# EAGLE schematic amg8833 (EAGLE 8.5.0)
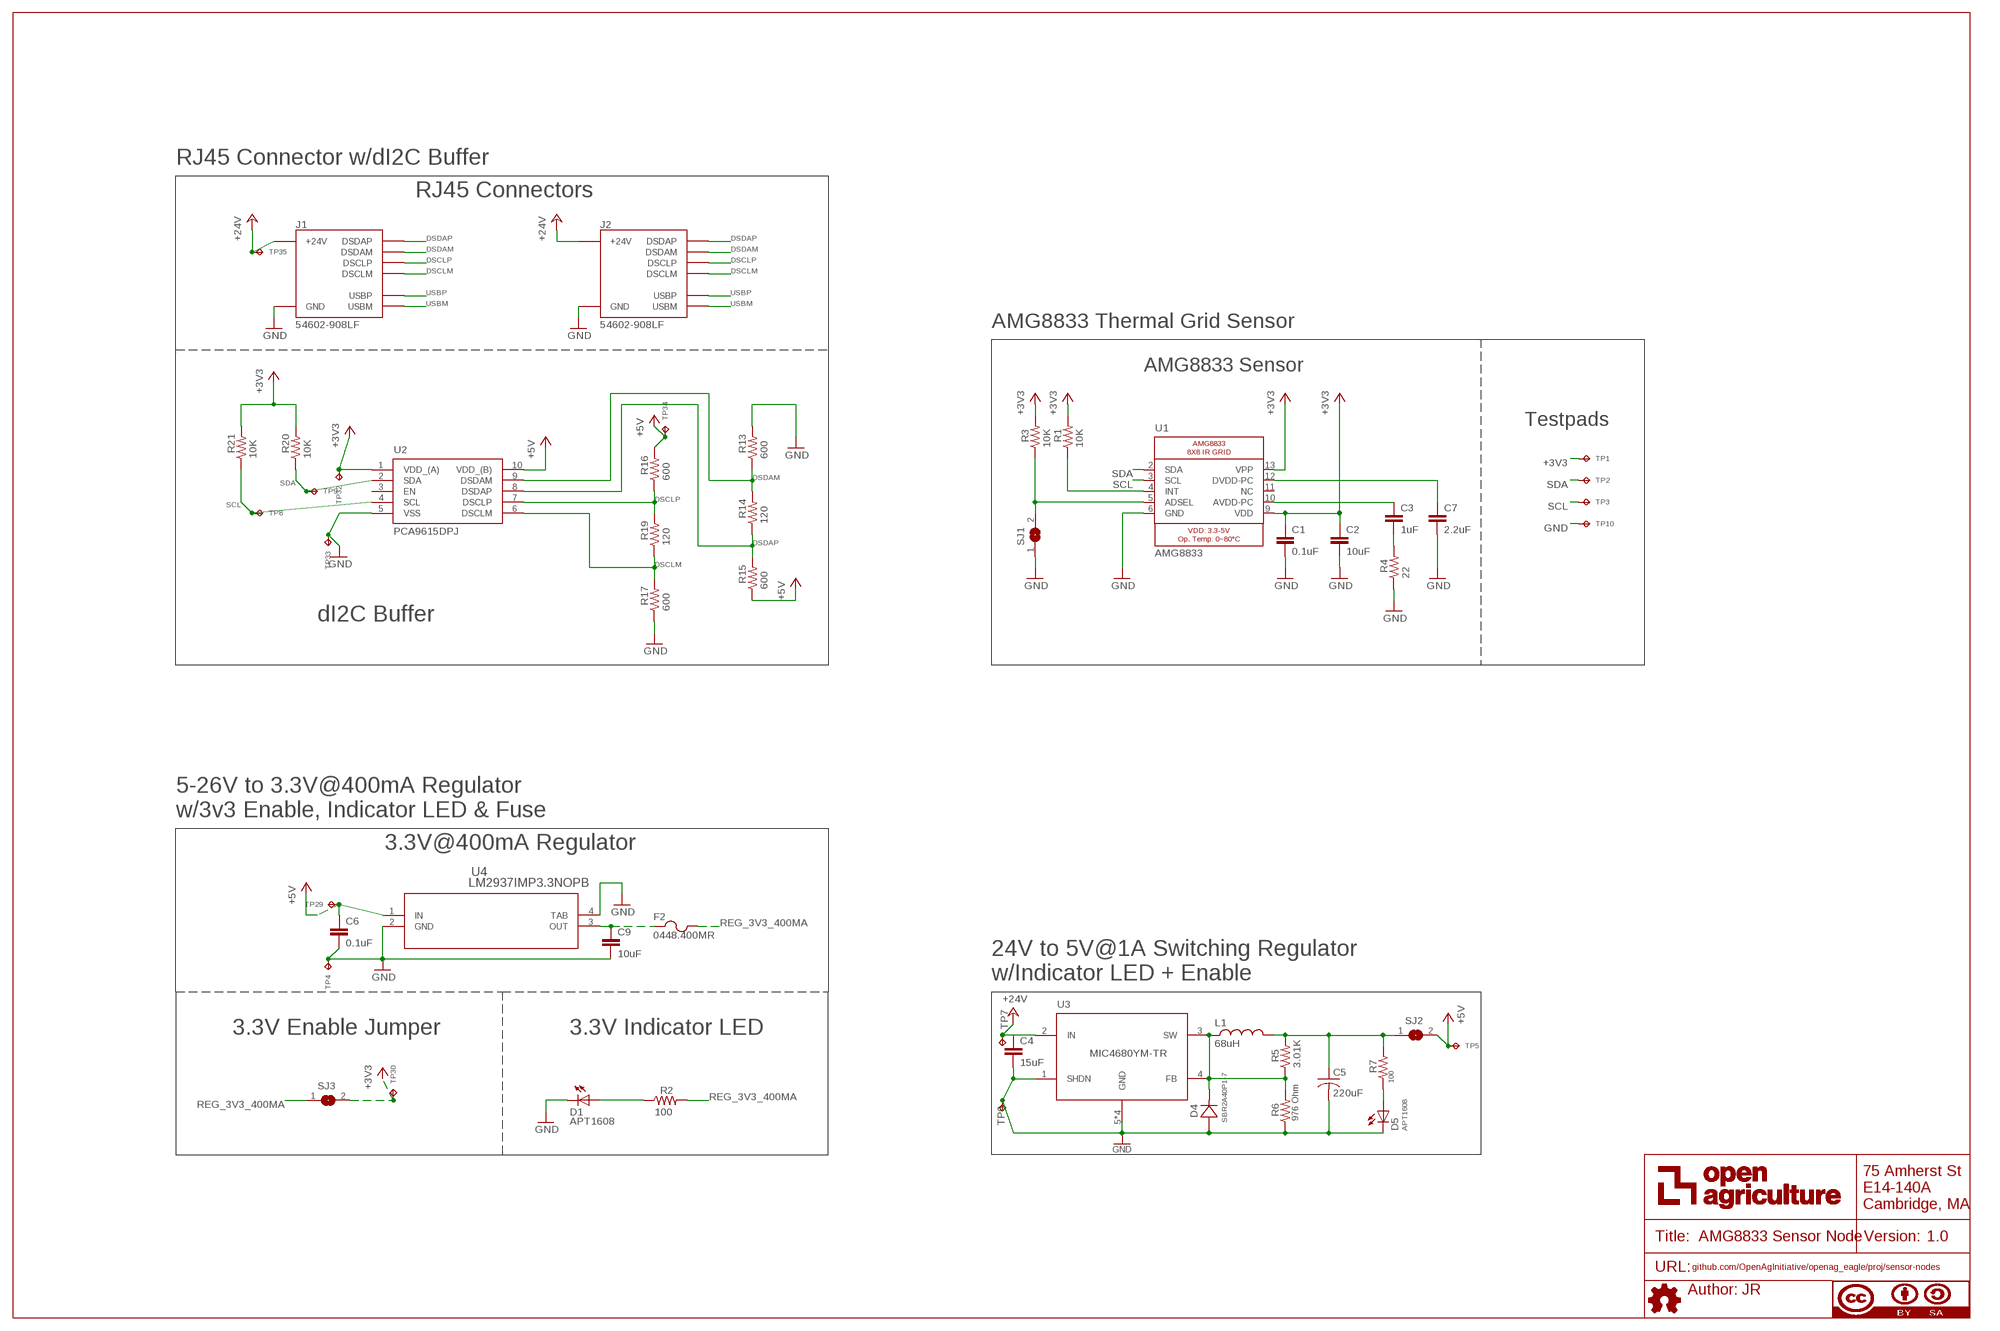
[diagram p0: schematic, sheet 1]

## Parts
C1  0.1uF  0.1UF-C0603C104K5RACTU  [C0603]
C2  10uF  10UF-GMK212BBJ106KG-T  [C0805]
C3  1uF  1UF-CL10A105KB8NNNC  [C0603]
C4  15uF  15UF-C2012X5R1V156M125AC  [C0805]
C5  220uF  220UF-TPSY227K010R0100  [CT7343]
C6  0.1uF  0.1UF-C0603C104K5RACTU  [C0603]
C7  2.2uF  2.2UF-GRM188R6YA225KA12D  [C0603]
C9  10uF  10UF-GMK212BBJ106KG-T  [C0805]
D1  APT1608  APT1608CGCK  [CHIPLED_0603]
D4  SBR2A40P1-7  [POWERDI123]
D5  APT1608  APT1608CGCK  [CHIPLED_0603]
F2  0448.400MR  0438.375WR  [0603]
FRAME1  DOCFIELD  [DOCFIELD]
J1  54602-908LF  OPENAG-V1-RJ45PTH  [OPENAG-V1-RJ45]
J2  54602-908LF  OPENAG-V1-RJ45PTH  [OPENAG-V1-RJ45]
L1  68uH  68UH-UP2B-680-R  [UP2B]
R1  10K  10K-ERJ-3EKF1002V  [RC0603N]
R2  100  100OHM-RC0603JR-07100RL  [RC0603N]
R3  10K  10K-ERJ-3EKF1002V  [RC0603N]
R4  22  22OHM-RC0603JR-0722RL  [RC0603N]
R5  3.01K  3.01K-RC0603FR-073K01L  [RC0603N]
R6  976 Ohm  982OHM-RC0603FR-07976RL  [RC0603N]
R7  100  100OHM-RC0603JR-07100RL  [RC0603N]
R13  600  600OHM-RC0603FR-07604RL  [RC0603N]
R14  120  120OHM-RC0603FR-07120RL  [RC0603N]
R15  600  600OHM-RC0603FR-07604RL  [RC0603N]
R16  600  600OHM-RC0603FR-07604RL  [RC0603N]
R17  600  600OHM-RC0603FR-07604RL  [RC0603N]
R19  120  120OHM-RC0603FR-07120RL  [RC0603N]
R20  10K  10K-ERJ-3EKF1002V  [RC0603N]
R21  10K  10K-ERJ-3EKF1002V  [RC0603N]
SJ1  SOLDERJUMPERREFLOW_NOPASTE  [SOLDERJUMPER_REFLOW_NOPASTE]
SJ2  SOLDERJUMPERREFLOW_NOPASTE  [SOLDERJUMPER_REFLOW_NOPASTE]
SJ3  SOLDERJUMPERREFLOW_NOPASTE  [SOLDERJUMPER_REFLOW_NOPASTE]
TP1  TPTP04R  [TP04R]
TP2  TPTP04R  [TP04R]
TP3  TPTP04R  [TP04R]
TP4  TPTP06R  [TP06R]
TP5  TPTP06R  [TP06R]
TP6  TPTP06R  [TP06R]
TP7  TPTP06R  [TP06R]
TP8  TPTP06R  [TP06R]
TP9  TPTP06R  [TP06R]
TP10  TPTP04R  [TP04R]
TP29  TPTP06R  [TP06R]
TP30  TPTP06R  [TP06R]
TP32  TPTP06R  [TP06R]
TP33  TPTP06R  [TP06R]
TP34  TPTP06R  [TP06R]
TP35  TPTP06R  [TP06R]
U1  AMG8833  [AMG8833]
U2  PCA9615DPJ  [SOP50P490X110-10N]
U3  MIC4680YM-TR  [SOIC8]
U4  LM2937IMP3.3NOPB  LM2937IMP-3.3/NOPB  [MP04A]

## Nets
+3V3: C1.1 C2.1 R1.2 R3.2 R20.2 R21.2 SJ3.2 TP1.1(TP) TP30.TP TP32.TP U1.9(VDD) U1.13(VPP) U2.1(VDD_(A))
+5V: C6.1 R15.1 R16.2 SJ2.2 TP5.TP TP29.TP TP34.TP U2.10(VDD_(B)) U4.1(IN)
+24V: C4.1 J1.24V(6)(+24V) J2.24V(6)(+24V) TP7.TP TP35.TP U3.2(IN)
DSCLM: J1.DSCLM(5)(DSCLM) J2.DSCLM(5)(DSCLM) R17.2 R19.1 U2.6(DSCLM)
DSCLP: J1.DSCLP(4)(DSCLP) J2.DSCLP(4)(DSCLP) R16.1 R19.2 U2.7(DSCLP)
DSDAM: J1.DSDAM(2)(DSDAM) J2.DSDAM(2)(DSDAM) R13.1 R14.2 U2.9(DSDAM)
DSDAP: J1.DSDAP(1)(DSDAP) J2.DSDAP(1)(DSDAP) R14.1 R15.2 U2.8(DSDAP)
GND: C1.2 C2.2 C4.2 C5.-(2(-)) C6.2 C7.2 C9.2 D1.C D4.- D5.C J1.GND(3)(GND) J2.GND(3)(GND) R4.1 R6.1 R13.2 R17.1 SJ1.1 TP4.TP TP6.TP TP10.1(TP) TP33.TP U1.6(GND) U2.5(VSS) U3.1(SHDN) U3.5(GND) U3.6(GND) U3.7(GND) U3.8(GND) U4.2(GND) U4.4(TAB)
N$4: D1.A R2.1
N$5: C9.1 F2.1 U4.3(OUT)
N$6: R1.1 U1.4(INT)
N$7: R3.1 SJ1.2 U1.5(ADSEL)
N$8: C3.2 R4.2
N$12: C3.1 U1.10(AVDD-PC)
N$13: C7.1 U1.12(DVDD-PC)
N$31: D4.+ L1.1 R5.1 R6.2 U3.3(SW) U3.4(FB)
N$32: D5.A R7.1
N$33: C5.+(1(+)) L1.2 R5.2 R7.2 SJ2.1
REG_3V3_400MA: F2.2 R2.2 SJ3.1
SCL: R21.1 TP3.1(TP) TP8.TP U1.3(SCL) U2.4(SCL)
SDA: R20.1 TP2.1(TP) TP9.TP U1.2(SDA) U2.2(SDA)
USBM: J1.USBM(8)(USBM) J2.USBM(8)(USBM)
USBP: J1.USBP(7)(USBP) J2.USBP(7)(USBP)
Unconnected: U1.11(NC) U2.3(EN)

## Notes on the sheet
- RJ45 Connector w/dI2C Buffer
- RJ45 Connectors
- AMG8833 Thermal Grid Sensor
- AMG8833 Sensor
- Testpads
- dI2C Buffer
- 5-26V to 3.3V@400mA Regulator 
  w/3v3 Enable, Indicator LED & Fuse
- 3.3V@400mA Regulator
- 24V to 5V@1A Switching Regulator
  w/Indicator LED + Enable
- 3.3V Enable Jumper | 3.3V Indicator LED

## Library data of the parts
C1 C6 = openag-capacitors:0.1UF-C0603C104K5RACTU: Kemet - C0603C104K5RACTU - CAP CER 0.1UF 50V X7R 0603 Description: 0.1µF ±10% 50V Ceramic Capacitor X7R 0603 (1608 Metric) Technical Specifications: Capacitance: 0.1µF Tolerance: ±10% Rated Voltage: 50V Temperature Coefficient: X7R Operating Temperature: -55°C ~ 125°C Package / Case: 0603 (1608 Metric) Datasheet(s): X7R Dielectric, 6.3-250 VDC <https://search.kemet.com/component-edge/download/datasheet/C0603C104K5RACTU.pdf> Vendor(s): Digikey: 399-5089-1-ND <https://www.digikey.com/product-detail/en/kemet/C0603C104K5RACTU/399-5089-1-ND/1465623>; POPULATE: YES; VERIFIED: NO
C2 C9 = openag-capacitors:10UF-GMK212BBJ106KG-T: Taiyo Yuden - GMK212BBJ106KG-T - CAP CER 10UF 35V X5R 0805 Description: 10µF ±10% 35V Ceramic Capacitor X5R 0805 (2012 Metric) Technical Specifications: Capacitance: 10µF Tolerance: ±10% Rated Voltage: 35V Temperature Coefficient: X5R Operating Temperature: -55°C ~ 85°C Package / Case: 0805 (2012 Metric) Datasheet(s): GMK212BBJ106KG-T Spec <http://ds.yuden.co.jp/TYCOMPAS/ut/detail.do?productNo=GMK212BBJ106KG-T&fileName=GMK212BBJ106KG-T_SS&mode=specSheetDownload> Vendor(s): Digikey: 587-4893-1-ND <https://www.digikey.com/product-detail/en/taiyo-yuden/GMK212BBJ106KG-T/587-4893-1-ND/6563736>; POPULATE: YES; VERIFIED: NO
C3 = openag-capacitors:1UF-CL10A105KB8NNNC: Samsung - CL10A105KB8NNNC - CAP CER 1UF 50V X5R 0603 Description: 1µF ±10% 50V Ceramic Capacitor X5R 0603 (1608 Metric) Technical Specifications: Capacitance: 1µF Tolerance: ±10% Rated Voltage: 50V Temperature Coefficient: X5R Operating Temperature: -55°C ~ 85°C Packaging / Case: 0603 (1608 Metric) Datasheet(s): CL10A105KB8NNNC Spec <http://www.samsungsem.com/kr/support/product-search/mlcc/CL10A105KB8NNNC.jsp> Vendor(s): Digikey: 1276-1860-1-ND <https://www.digikey.com/product-detail/en/samsung-electro-mechanics-america-inc/CL10A105KB8NNNC/1276-1860-1-ND/3889946>; POPULATE: YES; VERIFIED: NO
C4 = openag-capacitors:15UF-C2012X5R1V156M125AC: TDK Corporation - C2012X5R1V156M125AC - CAP CER 15UF 35V X5R 0805 Description: 15µF ±20% 35V Ceramic Capacitor X5R 0805 (2012 Metric) Technical Specifications: Capacitance: 15µF Tolerance: ±20% Voltage - Rated: 35V Temperature Coefficient: X5R Operating Temperature: -55°C ~ 85°C Features: Low ESL Applications: General Purpose Mounting Type: Surface Mount, MLCC Package / Case: 0805 (2012 Metric) Size / Dimension: 0.079" L x 0.049" W (2.00mm x 1.25mm) Thickness (Max): 0.057" (1.45mm) Datasheet(s): C Series, General Datasheet <https://product.tdk.com/info/en/catalog/datasheets/mlcc_commercial_general_en.pdf> MLCC Part Number Guide <https://product.tdk.com/en/products/common/pdf/mlcc_partnumber_description.pdf> C Series, Gen Appl & Mid-Voltage Spec <https://product.tdk.com/info/en/catalog/spec/mlccspec_commercial_general_midvoltage_en.pdf> Vendor(s): Digikey: 445-14423-1-ND <https://www.digikey.com/product-detail/en/tdk-corporation/C2012X5R1V156M125AC/445-14423-1-ND/3956089>
C5 = openag-capacitors:220UF-TPSY227K010R0100: AVX Corporation - TPSY227K010R0100 - CAP TANT 220UF 10V 10% 2917 Description: 220µF Molded Tantalum Capacitors 10V 2917 (7343 Metric) 100 mOhm Technical Specifications: Capacitance: 220µF Tolerance: ±10% Voltage - Rated: 10V Type: Molded ESR (Equivalent Series Resistance): 100 mOhm Operating Temperature: -55°C ~ 125°C Mounting Type: Surface Mount Package / Case: 2917 (7343 Metric) Size / Dimension: 0.287" L x 0.169" W (7.30mm x 4.30mm) Height - Seated (Max): 0.079" (2.00mm) Manufacturer Size Code: Y Features: General Purpose Datasheet(s): TPS Series, Low ESR <http://datasheets.avx.com/TPS.pdf> Vendor(s): Digikey: 478-5408-1-ND <https://www.digikey.com/scripts/DkSearch/dksus.dll?Detail&itemSeq=250948888&uq=636531796868737363>
C7 = openag-capacitors:2.2UF-GRM188R6YA225KA12D: Murata Electronics North America - GRM188R6YA225KA12D - CAP CER 2.2UF 35V X5R 0603 Description: 2.2µF ±10% 35V Ceramic Capacitor X5R 0603 (1608 Metric) Technical Specifications: Capacitance: 2.2µF Tolerance: ±10% Voltage - Rated: 35V Temperature Coefficient: X5R Operating Temperature: -55°C ~ 85°C Applications: General Purpose Mounting Type: Surface Mount, MLCC Package / Case: 0603 (1608 Metric) Size / Dimension: 0.063" L x 0.032" W (1.60mm x 0.80mm) Thickness (Max): 0.035" (0.90mm) Datasheet(s): Chip Monolithic Ceramic Caps Catalog <https://www.murata.com/~/media/webrenewal/support/library/catalog/products/capacitor/mlcc/c02e.ashx> Chip Monolithic Ceramic Caps Part Numbering <https://search.murata.co.jp/Ceramy/image/img/A01X/partnumbering_e_01.pdf> Specifications and Test Methods 3p <http://search.murata.co.jp/Ceramy/image/img/A01X/C1606E.pdf> GRM188R6YA225KA12 Ref Sheet <http://search.murata.co.jp/Ceramy/image/img/A01X/G101/ENG/GRM188R6YA225KA12-01.pdf> Vendor(s): Digikey: 490-7204-1-ND <https://www.digikey.com/product-detail/en/murata-electronics-north-america/GRM188R6YA225KA12D/490-7204-1-ND/3900456>
D1 D5 = openag-diodes:APT1608CGCK: Kingbright - APT1608CGCK - LED GREEN CLEAR 0603 SMD Description: Green 570nm LED Indication - Discrete 2.1V 0603 (1608 Metric) Technical Specifications: Color: Green Lens Color: Colorless Lens Transparency: Clear Millicandela Rating: 50mcd Lens Style/Size: Rectangle with Flat Top, 1.20mm x 0.80mm Voltage - Forward (Vf) (Typ): 2.1V Current - Test: 20mA Viewing Angle: 120° Mounting Type: Surface Mount Wavelength - Dominant: 570nm Wavelength - Peak: 574nm Package / Case: 0603 (1608 Metric) Supplier Device Package: Chip LED Size / Dimension: 1.60mm L x 0.80mm W Height (Max): 0.75mm Datasheet(s): APT1608CGCK <http://www.kingbrightusa.com/images/catalog/SPEC/APT1608CGCK.pdf> Vendor(s): Digikey: 754-1116-1-ND <https://www.digikey.com/product-detail/en/kingbright/APT1608CGCK/754-1116-1-ND/1747833#>; POPULATE: YES; VERIFIED: NO
D4 = openag-diodes:SBR2A40P1-7: Diodes Incorporated - SBR2A40P1-7 - DIODE SBR 40V 2A POWERDI123 Description: Diode Super Barrier 40V 2A Surface Mount PowerDI™ 123 Technical Specifications: Diode Type: Super Barrier Voltage - DC Reverse (Vr) (Max): 40V Current - Average Rectified (Io): 2A Voltage - Forward (Vf) (Max) @ If: 500mV @ 2A Speed: Standard Recovery >500ns, > 200mA (Io) Current - Reverse Leakage @ Vr: 100µA @ 40V Mounting Type: Surface Mount Package / Case: POWERDI®123 Supplier Device Package: PowerDI™ 123 Operating Temperature - Junction: -65°C ~ 150°C Base Part Number: SBR2A40 Datasheet(s): SBR2A40P1 <https://www.diodes.com/assets/Datasheets/SBR2A40P1.pdf> Vendor(s): Digikey: SBR2A40P1DITR-ND <https://www.digikey.com/product-detail/en/diodes-incorporated/SBR2A40P1-7/SBR2A40P1DITR-ND/1681825>
F2 = openag-fuses:0438.375WR: Littelfuse Inc. - 0448.400MR - FUSE BOARD MNT 400MA 125VAC/VDC Description: FUSE BOARD MNT 400MA 125VAC/VDC Technical Specifications: Fuse Type: Board Mount (Cartridge Style Excluded) Current Rating: 400mA Voltage Rating - AC: 125V Voltage Rating - DC: 125V Response Time: Fast Package / Case: 2-SMD, Square End Block Mounting Type: Surface Mount Breaking Capacity @ Rated Voltage: 50A Melting I²t: 0.0416 Approvals: CSA, UL Operating Temperature: -55°C ~ 125°C Size / Dimension: 0.240" L x 0.106" W x 0.106" H (6.10mm x 2.69mm x 2.69mm) DC Cold Resistance: 0.4895 Ohms Datasheet(s): 448 Series Datasheet <http://www.littelfuse.com/~/media/electronics/datasheets/fuses/littelfuse_fuse_448_datasheet.pdf.pdf> Vendor(s): Digikey: F5573CT-ND <https://www.digikey.com/product-detail/en/littelfuse-inc/0448.400MR/F5573CT-ND/3306934>; POPULATE: YES; VERIFIED: YES
FRAME1 = openag-frames:DOCFIELD: DOCUMENT FIELD; AUTHOR: JR; TITLE: AMG8833 Sensor Node; URL: github.com/OpenAgInitiative/openag_eagle/proj/sensor-nodes; VER: 1.0
J1 J2 = openag_connector:OPENAG-V1-RJ45: Amphenol FCI - 54602-908LF - CONN MOD JACK 8P8C R/A UNSHLD Description: Jack Modular Connector 8p8c (RJ45, Ethernet) 90� Angle (Right) Unshielded Cat3 Technical Specifications: Connector Type: Jack Number of Positions/Contacts: 8p8c (RJ45, Ethernet) Number of Ports: 1 Number of Rows: 1 Mounting Type: Through Hole Orientation: 90� Angle (Right) Termination: Solder Shielding: Unshielded Ratings: Cat3 Features: Board Lock LED Color: Does Not Contain LED Tab Direction: Down Contact Material: Copper Alloy Contact Finish: Gold Contact Finish Thickness: 15�in (0.38�m) Housing Material: Polyester, Glass Filled Operating Temperature: -40�C ~ 70�C Datasheet(s): 54601-x04(zzz)WPLF Drawing <http://cdn.amphenol-icc.com/media/wysiwyg/files/drawing/c-bmj-0102.pdf> Vendor(s): Digikey: 609-1046-ND <https://www.digikey.com/product-detail/en/amphenol-fci/54602-908LF/609-1046-ND/1001360>; POPULATE: YES; VERIFIED: NO
L1 = openag-inductors:68UH-UP2B-680-R: Eaton - UP2B-680-R - FIXED IND 68UH 1.5A 178.7 MOHM Description: 68µH Unshielded Wirewound Inductor 1.5A 178.7 mOhm Max Nonstandard Technical Specifications: Type: Wirewound Material - Core: Ferrite Inductance: 68µH Tolerance: ±20% Current Rating: 1.5A Current - Saturation: 1.2A Shielding: Unshielded DC Resistance (DCR): 178.7 mOhm Max Operating Temperature: -40°C ~ 85°C Frequency - Test: 100kHz Mounting Type: Surface Mount Package / Case: Nonstandard Size / Dimension: 0.550" L x 0.410" W (13.97mm x 10.41mm) Height - Seated (Max): 0.236" (6.00mm) Datasheet(s): UNI-PAC (-R) <http://www.cooperindustries.com/content/dam/public/bussmann/Electronics/Resources/product-datasheets/BUS_Elx_PM_4308_UNI_PAC_Power_Inductors.pdf> Vendor(s): Digikey: 513-1083-1-ND <https://www.digikey.com/scripts/DkSearch/dksus.dll?Detail&itemSeq=250945518&uq=636531821133403587>
R1 R3 R20 R21 = openag-resistors:10K-ERJ-3EKF1002V: Panasonic - ERJ-3EKF1002V - RES SMD 10K OHM 1% 1/10W 0603 Description: 10 kOhms ±1% 0.1W, 1/10W Chip Resistor 0603 (1608 Metric) Automotive AEC-Q200 Thick Film Technical Specifications: Resistance: 10kOhms Tolerance: ±1% Power: 0.1W, 1/10W Operating Temperature: -55°C ~ 155°C Package/Case: 0603 (1608 Metric) Datasheet(s): ERJ-3EKF1002V View All Specifications <https://industrial.panasonic.com/ww/products/resistors/chip-resistors/general-purpose-chip-resistors/precision-thick-film-chip-resistors/ERJ3EKF1002V> Vendor(s): Digikey: P10.0KHCT-ND <https://www.digikey.com/product-detail/en/panasonic-electronic-components/ERJ-3EKF1002V/P10.0KHCT-ND/198102>; POPULATE: YES; VERIFIED: NO
R2 R7 = openag-resistors:100OHM-RC0603JR-07100RL: Yageo - RC0603JR-07100RL - RES SMD 100 OHM 5% 1/10W 0603 Description: 100 Ohms ±5% 0.1W, 1/10W Chip Resistor 0603 (1608 Metric) Moisture Resistant Thick Film Technical Specifications: Resistance: 100 Ohms Tolerance: ±5% Power (Watts): 0.1W, 1/10W Composition: Thick Film Features: Moisture Resistant Temperature Coefficient: ±100ppm/°C Operating Temperature: -55°C ~ 155°C Package / Case: 0603 (1608 Metric) Supplier Device Package: 0603 Size / Dimension: 0.063" L x 0.032" W (1.60mm x 0.80mm) Height - Seated (Max): 0.022" (0.55mm) Number of Terminations: 2 Datasheet(s): Thick Film Chip Resistor Intro <http://www.yageo.com.tw/exep/pages/download/literatures/PYu-R_INT-thick_7.pdf> Chip Resistor Marking <http://www.yageo.com/exep/pages/download/literatures/PYu-R_Marking_2.pdf> RC Series, L Datasheet <http://www.yageo.com/documents/recent/PYu-RC_Group_51_RoHS_L_8.pdf> Vendor(s): Digikey: 311-100GRCT-ND <https://www.digikey.com/product-detail/en/yageo/RC0603JR-07100RL/311-100GRCT-ND/729644>; POPULATE: YES; VERIFIED: NO
R4 = openag-resistors:22OHM-RC0603JR-0722RL: Yageo - RC0603JR-0722RL - RES SMD 22 OHM 5% 1/10W 0603 Description: 22 Ohms ±5% 0.1W, 1/10W Chip Resistor 0603 (1608 Metric) Moisture Resistant Thick Film Technical Specifications: Resistance: 22 Ohms Tolerance: ±5% Power (Watts): 0.1W, 1/10W Composition: Thick Film Features: Moisture Resistant Temperature Coefficient: ±100ppm/°C Operating Temperature: -55°C ~ 155°C Package / Case: 0603 (1608 Metric) Supplier Device Package: 0603 Size / Dimension: 0.063" L x 0.032" W (1.60mm x 0.80mm) Height - Seated (Max): 0.022" (0.55mm) Number of Terminations: 2 Datasheet(s): RC Series, L Datasheet <http://www.yageo.com/documents/recent/PYu-RC_Group_51_RoHS_L_8.pdf> Chip Resistor Marking <http://www.yageo.com/exep/pages/download/literatures/PYu-R_Marking_2.pdf> Vendor(s): Digikey: 311-22GRCT-ND <https://www.digikey.com/product-detail/en/yageo/RC0603JR-0722RL/311-22GRCT-ND/729690>
R5 = openag-resistors:3.01K-RC0603FR-073K01L: Yageo - RC0603FR-073K01L - RES SMD 3.01K OHM 1% 1/10W 0603 Description: 3.01 kOhms ±1% 0.1W, 1/10W Chip Resistor 0603 (1608 Metric) Moisture Resistant Thick Film Technical Specifications: Resistance: 3.01 kOhms Tolerance: ±1% Power (Watts): 0.1W, 1/10W Composition: Thick Film Features: Moisture Resistant Temperature Coefficient: ±100ppm/°C Operating Temperature: -55°C ~ 155°C Package / Case: 0603 (1608 Metric) Supplier Device Package: 0603 Size / Dimension: 0.063" L x 0.032" W (1.60mm x 0.80mm) Height - Seated (Max): 0.022" (0.55mm) Number of Terminations: 2 Datasheet(s): Chip Resistor Marking <http://www.yageo.com/exep/pages/download/literatures/PYu-R_Marking_2.pdf> RC Series, L Datasheet <http://www.yageo.com/documents/recent/PYu-RC_Group_51_RoHS_L_8.pdf> Vendor(s): Digikey: 311-3.01KHRCT-ND <https://www.digikey.com/scripts/DkSearch/dksus.dll?Detail&itemSeq=250949714&uq=636531832410541188>
R6 = openag-resistors:982OHM-RC0603FR-07976RL: Yageo - RC0603FR-07976RL - RES SMD 976 OHM 1% 1/10W 0603 Description: 976 Ohms ±1% 0.1W, 1/10W Chip Resistor 0603 (1608 Metric) Moisture Resistant Thick Film Technical Specifications: Resistance: 976 Ohms Tolerance: ±1% Power (Watts): 0.1W, 1/10W Composition: Thick Film Features: Moisture Resistant Temperature Coefficient: ±100ppm/°C Operating Temperature: -55°C ~ 155°C Package / Case: 0603 (1608 Metric) Supplier Device Package: 0603 Size / Dimension: 0.063" L x 0.032" W (1.60mm x 0.80mm) Height - Seated (Max): 0.022" (0.55mm) Number of Terminations: 2 Datasheet(s): Chip Resistor Marking <http://www.yageo.com/exep/pages/download/literatures/PYu-R_Marking_2.pdf> RC Series, L Datasheet <http://www.yageo.com/documents/recent/PYu-RC_Group_51_RoHS_L_8.pdf> Vendor(s): Digikey: 311-976HRCT-ND <https://www.digikey.com/scripts/DkSearch/dksus.dll?Detail&itemSeq=250949870&uq=636531835229553061>
R13 R15-R17 = openag-resistors:600OHM-RC0603FR-07604RL: Yageo - RC0603FR-07604RL - RES SMD 604 OHM 1% 1/10W 0603 Description: 604 Ohms ±1% 0.1W, 1/10W Chip Resistor 0603 (1608 Metric) Moisture Resistant Thick Film Technical Specifications: Resistance: 604 Ohms Tolerance: ±1% Power (Watts): 0.1W, 1/10W Composition: Thick Film Features: Moisture Resistant Temperature Coefficient: ±100ppm/°C Operating Temperature: -55°C ~ 155°C Package / Case: 0603 (1608 Metric) Supplier Device Package: 0603 Size / Dimension: 0.063" L x 0.032" W (1.60mm x 0.80mm) Height - Seated (Max): 0.022" (0.55mm) Number of Terminations: 2 Datasheet(s): RC Series, L Datasheet <http://www.yageo.com/documents/recent/PYu-RC_Group_51_RoHS_L_8.pdf> Chip Resistor Marking <http://www.yageo.com/exep/pages/download/literatures/PYu-R_Marking_2.pdf> Vendor(s): Digikey: 311-604HRCT-ND <https://www.digikey.com/product-detail/en/yageo/RC0603FR-07604RL/311-604HRCT-ND/730276>
R14 R19 = openag-resistors:120OHM-RC0603FR-07120RL: Yageo - RC0603FR-07120RL - RES SMD 120 OHM 1% 1/10W 0603 Description: 120 Ohms ±1% 0.1W, 1/10W Chip Resistor 0603 (1608 Metric) Moisture Resistant Thick Film Technical Specifications: Resistance: 120 Ohms Tolerance: ±1% Power (Watts): 0.1W, 1/10W Composition: Thick Film Features: Moisture Resistant Temperature Coefficient: ±100ppm/°C Operating Temperature: -55°C ~ 155°C Package / Case: 0603 (1608 Metric) Supplier Device Package: 0603 Size / Dimension: 0.063" L x 0.032" W (1.60mm x 0.80mm) Height - Seated (Max): 0.022" (0.55mm) Number of Terminations: 2 Datasheet(s): RC Series, L Datasheet <http://www.yageo.com/documents/recent/PYu-RC_Group_51_RoHS_L_8.pdf> Chip Resistor Marking <http://www.yageo.com/exep/pages/download/literatures/PYu-R_Marking_2.pdf> Vendor(s): Digikey: 311-120HRCT-ND <https://www.digikey.com/product-detail/en/yageo/RC0603FR-07120RL/311-120HRCT-ND/729867>
SJ1-SJ3 = openag-connectors:SOLDERJUMPER: SMD Solder JUMPER Solder the two pads together to create a connection, or remove the solder to break it. REFLOW - Use this footprint for solder paste and reflow ovens. WAVE - Use this footprint for hand-soldering (larger pads). CLOSED - Has a trace between the two pads to ensure it is closed by default. The trace needs to be cut to disable the jumper, and can be closed again by creating a solder bridge between the two pads.; POPULATE: YES; VERIFIED: NO
TP1-TP10 TP29 TP30 TP32-TP35 = openag-testpads:TP: Test pad
U1 = openag-sensors:AMG8833: Panasonic Electronic Components - AMG8833 - SENSOR GRID-EYE 3.3V HIGH GAIN Description: Temperature Sensor Digital, Infrared (IR) 14-SMD Module Technical Specifications: Sensor Type: Digital, Infrared (IR) Sensing Temperature - Remote: 0°C ~ 80°C (IR) Output Type: I²C Voltage - Supply: 3.3V Features: Sleep Mode, Standby Mode Accuracy - Highest (Lowest): ±2.5°C Test Condition: 0°C ~ 80°C Operating Temperature: 0°C ~ 80°C Mounting Type: Surface Mount Package / Case: 14-SMD Module Supplier Device Package: 14-SMD Module Datasheet(s): AMG88x3,4 Grid-EYE® Sensor Datasheet <//media.digikey.com/pdf/Data%20Sheets/Panasonic%20Sensors%20PDFs/Grid-EYE_AMG88.pdf> Built-in Sensors Catalog <https://industrial.panasonic.com/content/data/CP/PDF/built-in_sensor_catalog_e.pdf> Grid-EYE AMG88 Safety Precautions <http://industrial.panasonic.com/cdbs/www-data/pdf/ADI8000/ADI8000COL2.pdf> Passive Infrared Sensors Selection Guide <https://na.industrial.panasonic.com/sites/default/pidsa/files/downloads/files/pir_sensors_guide.pdf> Vendor(s): Digikey: P19002CT-ND <https://www.digikey.com/short/qjp7rn>
U2 = openag-buffers:PCA9615DPJ: NXP USA Inc. - PCA9615DPJ - IC REDRIVER I2C 2CH 10TSSOP Description: Buffer, ReDriver 2 Channel 400kHz 10-TSSOP Technical Specifications: Type: Buffer, ReDriver Applications: I²C Input: 2-Wire Bus Output: 2-Wire Bus Data Rate (Max): 400kHz Number of Channels: 2 Capacitance - Input: 7pF Voltage - Supply: 2.3 V ~ 5.5 V Current - Supply: 16µA Operating Temperature: -40°C ~ 85°C Package / Case: 10-TFSOP, 10-MSOP (0.118", 3.00mm Width) Supplier Device Package: 10-TSSOP Base Part Number: PCA9615 Datasheet(s): PCA9615DP <http://www.nxp.com/documents/data_sheet/PCA9615.pdf> Vendor(s): Digikey: 568-11484-1-ND <https://www.digikey.com/product-detail/en/nxp-usa-inc/PCA9615DPJ/568-11484-1-ND/4864508>
U3 = openag-regulators:MIC4680YM-TR: Microchip Technology - MIC4680YM-TR - IC REG BUCK BOOST ADJ 1.3A 8SOIC Description: Buck, Buck-Boost Switching Regulator IC Positive Adjustable 1.23V 1 Output 1.3A 8-SOIC (0.154", 3.90mm Width) Technical Specifications: Function: Step-Down, Step-Up/Step-Down Output Configuration: Positive Topology: Buck, Buck-Boost Output Type: Adjustable Number of Outputs: 1 Voltage - Input (Min): 4V Voltage - Input (Max): 34V Voltage - Output (Min/Fixed): 1.23V Voltage - Output (Max): 32.98V Current - Output: 1.3A Frequency - Switching: 200kHz Synchronous Rectifier: No Operating Temperature: -40°C ~ 125°C (TJ) Mounting Type: Surface Mount Package / Case: 8-SOIC (0.154", 3.90mm Width) Supplier Device Package: 8-SOIC Base Part Number: MIC4680 Datasheet(s): MIC4680 <http://www.microchip.com/mymicrochip/filehandler.aspx?ddocname=en579250> Vendor(s): Digikey: 576-1222-1-ND <https://www.digikey.com/scripts/DkSearch/dksus.dll?Detail&itemSeq=250950999&uq=636531791983475304>
U4 = openag-regulators:LM2937IMP-3.3/NOPB: Texas Instruments - LM2937IMP-3.3/NOPB - IC REG LIN 3.3V 400MA SOT223-4 Description: Linear Voltage Regulator IC Positive Fixed 1 Output 3.3V 400mA SOT-223-4 Technical Specifications: Output Configuration: Positive Output Type: Fixed Number of Regulators: 1 Voltage - Input (Max): 26V Voltage - Output (Min/Fixed): 3.3V Voltage Dropout (Max): 1V @ 50mA Current - Output: 400mA Current - Quiescent (Iq): 2mA Current - Supply (Max): 1.25A Protection Features: Over Temperature, Reverse Polarity, Short Circuit Operating Temperature: -40°C ~ 85°C Mounting Type: Surface Mount Package / Case: TO-261-4, TO-261AA Supplier Device Package: SOT-223-4 Base Part Number: LM2937 Datasheet(s): LM2937-2.5, LM2937-3.3 Datasheet <http://www.ti.com/lit/ds/symlink/lm2937-2.5.pdf> Vendor(s): Digikey: LM2937IMP-3.3/NOPBCT-ND <https://www.digikey.com/product-detail/en/texas-instruments/LM2937IMP-3.3-NOPB/LM2937IMP-3.3-NOPBCT-ND/270742#>; POPULATE: YES; VERIFIED: NO